# Altium schematic sheet p2_eth_rs232.SchDoc
size A1; Organization: Protel International P/L; Address1: L3, 12a Rodborough Rd; Address2: Frenchs Forest; Address3: NSW; Address4: Australia 2086
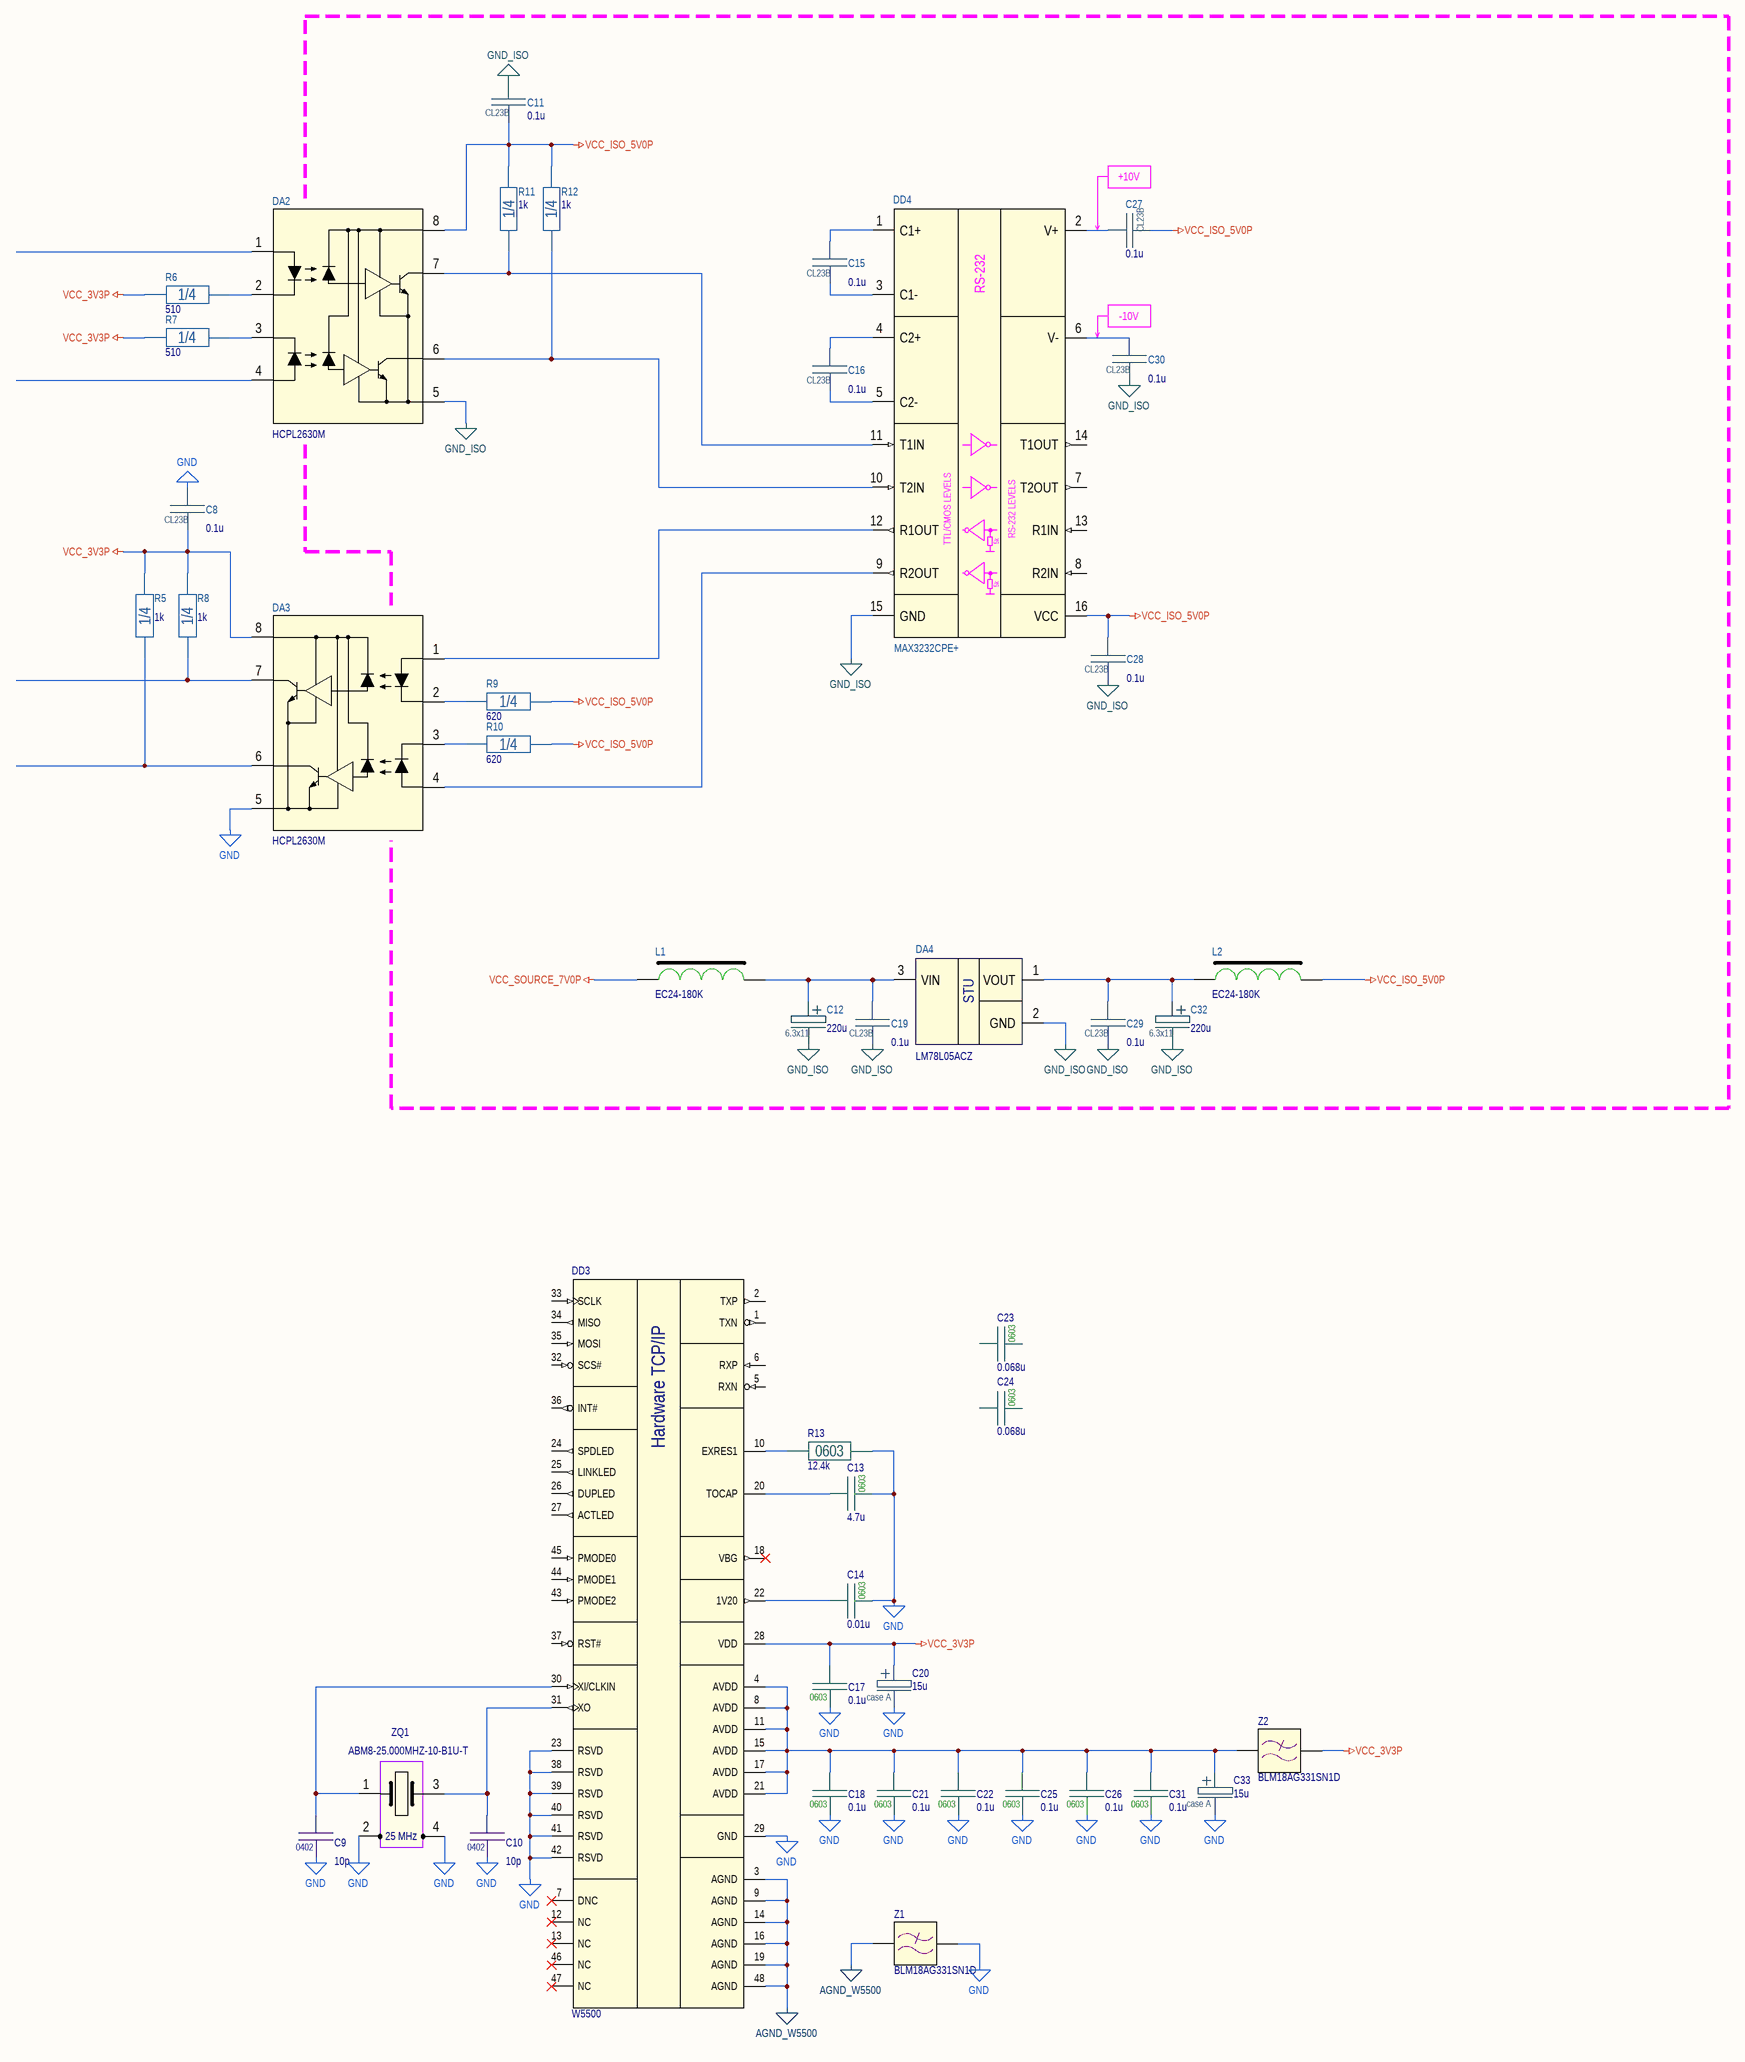
[diagram p0: p2_eth_rs232.SchDoc]

## Parts
C8  0.1u  [CL23B_7.2x2.5]
C9  10p  Package: 0402  [CAP0402]
C10  10p  Package: 0402  [CAP0402]
C11  0.1u  [CL23B_7.2x2.5]
C12  220u  Package: 6.3x11  [ECAP6.3X11X2.5_BRW]
C13  4.7u  Package: 0603  [CAP0603]
C14  0.01u  Package: 0603  [CAP0603]
C15  0.1u  [CL23B_7.2x2.5]
C16  0.1u  [CL23B_7.2x2.5]
C17  0.1u  Package: 0603  [CAP0603]
C18  0.1u  Package: 0603  [CAP0603]
C19  0.1u  [CL23B_7.2x2.5]
C20  15u  Package: case A  [CAP_CASE_A]
C21  0.1u  Package: 0603  [CAP0603]
C22  0.1u  Package: 0603  [CAP0603]
C23  0.068u  Package: 0603  [CAP0603]
C24  0.068u  Package: 0603  [CAP0603]
C25  0.1u  Package: 0603  [CAP0603]
C26  0.1u  Package: 0603  [CAP0603]
C27  0.1u  [CL23B_7.2x2.5]
C28  0.1u  [CL23B_7.2x2.5]
C29  0.1u  [CL23B_7.2x2.5]
C30  0.1u  [CL23B_7.2x2.5]
C31  0.1u  Package: 0603  [CAP0603]
C32  220u  Package: 6.3x11  [ECAP6.3X11X2.5_BRW]
C33  15u  Package: case A  [CAP_CASE_A]
DA2  HCPL2630M  [DIP-8P-M01]
DA3  HCPL2630M  [DIP-8P-M01]
DA4  LM78L05ACZ  [TO-92 (VERTICAL,LINE)]
DD3  W5500  [LQFP-48]
DD4  MAX3232CPE+  [DIP-16P-M03]
L1  EC24-180K  [EC24_GREEN]
L2  EC24-180K  [EC24_GREEN]
R5  1k  Package: 1/4  [CFR-25]
R6  510  Package: 1/4  [CFR-25]
R7  510  Package: 1/4  [CFR-25]
R8  1k  Package: 1/4  [CFR-25]
R9  620  Package: 1/4  [CFR-25]
R10  620  Package: 1/4  [CFR-25]
R11  1k  Package: 1/4  [CFR-25]
R12  1k  Package: 1/4  [CFR-25]
R13  12.4k  Package: 0603  [RES0603B]
Z1  BLM18AG331SN1D  [BLM0603P]
Z2  BLM18AG331SN1D  [BLM0603P]
ZQ1  ABM8-25.000MHZ-10-B1U-T  [SMD3225]

## Nets
AGND_W5500: DD3.3(AGND) DD3.9(AGND) DD3.14(AGND) DD3.16(AGND) DD3.19(AGND) DD3.48(AGND) Z1.2
GND: C8.1 C9.1 C10.1 C13.2 C14.2 C17.1 C18.1 C20.2 C21.1 C22.1 C25.1 C26.1 C31.1 C33.2 DA3.5(GND) DD3.23(RSVD) DD3.29(GND) DD3.38(RSVD) DD3.39(RSVD) DD3.40(RSVD) DD3.41(RSVD) DD3.42(RSVD) R13.2 Z1.1 ZQ1.2(GND) ZQ1.4(GND)
GND_ISO: C11.1 C12.2 C19.2 C28.2 C29.2 C30.2 C32.2 DA2.5(GND) DA4.2(GND) DD4.15(GND)
VCC_3V3P: C8.2 C17.2 C20.1 DA3.8(VCC) DD3.28(VDD) R5.1 R6.1 R7.1 R8.1 Z2.1
VCC_ISO_5V0P: C11.2 C27.2 C28.1 DA2.8(VCC) DD4.16(VCC) L2.2 R9.1 R10.1 R11.1 R12.1
VCC_SOURCE_7V0P: L1.1
NetC9_2: C9.2 DD3.30(XI/CLKIN) ZQ1.1(XTAL0)
NetC10_2: C10.2 DD3.31(XO) ZQ1.3(XTAL1)
NetC12_1: C12.1 C19.1 DA4.3(VIN) L1.2
NetC13_1: C13.1 DD3.20(TOCAP)
NetC14_1: C14.1 DD3.22(1V20)
NetC15_1: C15.1 DD4.1(C1+)
NetC15_2: C15.2 DD4.3(C1-)
NetC16_1: C16.1 DD4.4(C2+)
NetC16_2: C16.2 DD4.5(C2-)
NetC18_2: C18.2 C21.2 C22.2 C25.2 C26.2 C31.2 C33.1 DD3.4(AVDD) DD3.8(AVDD) DD3.11(AVDD) DD3.15(AVDD) DD3.17(AVDD) DD3.21(AVDD) Z2.2
NetC27_1: C27.1 DD4.2(V+)
NetC29_1: C29.1 C32.1 DA4.1(VOUT) L2.1
NetC30_1: C30.1 DD4.6(V-)
NetDA2_2: DA2.2(CATHODE1) R6.2
NetDA2_3: DA2.3(CATHODE2) R7.2
NetDA2_6: DA2.6(V02) DD4.10(T2IN) R12.2
NetDA2_7: DA2.7(V01) DD4.11(T1IN) R11.2
NetDA3_1: DA3.1(ANODE1) DD4.12(R1OUT)
NetDA3_2: DA3.2(CATHODE1) R9.2
NetDA3_3: DA3.3(CATHODE2) R10.2
NetDA3_4: DA3.4(ANODE2) DD4.9(R2OUT)
NetDA3_6: DA3.6(V02) R5.2
NetDA3_7: DA3.7(V01) R8.2
NetDD3_10: DD3.10(EXRES1) R13.1

Not connected (* = marked no-connect by the designer): C23 1 2; C24 1 2; DA2 1(ANODE1) 4(ANODE2); DD3 1(TXN) 2(TXP) 5(RXN) 6(RXP) 7(DNC)* 12(NC)* 13(NC)* 18(VBG)* 24(SPDLED) 25(LINKLED) 26(DUPLED) 27(ACTLED) 32(SCS#) 33(SCLK) 34(MISO) 35(MOSI) 36(INT#) 37(RST#) 43(PMODE2) 44(PMODE1) 45(PMODE0) 46(NC)* 47(NC)*; DD4 7(T2OUT) 8(R2IN) 13(R1IN) 14(T1OUT)

## Notes on the sheet
- +10V
- -10V
- Title
- Size:
- Date:
- File:
- A1
- Number:
- Time:
- Revision:
- Sheet
- of
- (in symbol ABM8-25.000MHZ-10-B1U-T) 25 MHz
- (in symbol LM78L05ACZ) STU
- (in symbol MAX3232CPE+) RS-232; TTL/CMOS LEVELS; RS-232 LEVELS; 5k
- (in symbol W5500) Hardware TCP/IP

## Library data of the parts
C8 C11 C15 C16 C19 C27-C30 = CL23B: Box-type metallized polyester film capacitor; Tolerance: ± * %; Voltage: 63V; Value: 0.1u; Dielectric: Polyester; Value on schem: 0.1u; Part Number: *; Manufacturer: *; Package: CL23B
C9 C10 = C0402: Capacitors 0402 package case; Part Number: CL05C100JB5NNNC; Manufacturer: Samsung Sdi Co.ltd(SAMSUNG); Tolerance: ± 10 %; Dielectric: NP0; Voltage: 50 V; Value: 10p; Value on schem: 10p
C12 C32 = C_ECAP: Aluminium capacitor; Part Number: EKZH160ELL221MF11D; Manufacturer: Nichicon; Tolerance: ± 20 %; Voltage: 16V; Value: 220u; Value on schem: 220u
C13 = C0603: Capacitors 0603 package case; Part Number: CL10A475MO8NNNC; Manufacturer: Samsung Sdi Co. Ltd; Tolerance: ± 10 %; Dielectric: X5R; Voltage: 16 V; Value: 4.7u; Value on schem: 4.7u
C14 = C0603: Capacitors 0603 package case; Part Number: CL10B103KB8NNNL; Manufacturer: Samsung Sdi Co. Ltd; Tolerance: ± 10 %; Dielectric: X7R; Voltage: 50 V; Value: 0.01u; Value on schem: 0.01u
C17 C18 C21 C22 C25 C26 C31 = C0603: Capacitors 0603 package case; Part Number: CL10B104KB8NNNC; Manufacturer: Samsung Sdi Co. Ltd; Tolerance: ± 10 %; Dielectric: X7R; Voltage: 50V; Value: 0.1u; Value on schem: 0.1u
C20 C33 = C_CASEA: Tantalum capacitors case A; Part Number: 293D156X96R3A2TE3; Manufacturer: Vishay Intertechnology Inc.; Tolerance: ± 10 %; Voltage: 6.3V; ESR: 2.9Ohm @ 100 kHz; Value: 15u; Value on schem: 15u; Series: 293D
C23 C24 = C0603: Capacitors 0603 package case; Part Number: CL10B683KB8NNNC; Manufacturer: Samsung Sdi Co. Ltd; Tolerance: ± 10 %; Dielectric: X7R; Voltage: 50 V; Value: 0.068u; Value on schem: 0.068u
DA2 DA3 = HCPL2630M: Dual-Channel High-Speed 10 MBit/s Logic Gate Optocouplers; Manufacturer: ON Semiconductor; Package: DIP-8; Part Number: HCPL2630M
DA4 = LM78L05ACZ: 100-mA Fixed Output Linear Regulator; Manufacturer: Texas Instruments; Part Number: LM78L05ACZ; Package: TO-92
DD3 = W5500: Hardwired TCP/IP embedded Ethernet controller; Manufacturer: WIZnet; Part Number: W5500; Package: LQFP-64
DD4 = MAX3232CPE+: 3.0V to 5.5V, Low-Power, Up to 1Mbps, True RS-232 Transceivers; Manufacturer: Maxim Integrated; Part Number: MAX3232CPE+; Package: DIP-16
L1 L2 = EC24: Axial leaded coated inductors; Manufacturer: 3L Electronic; RDC: 1 Ohm; SRF Min: 15 MHz; Q: 40; Irms  Max: 315 mA; Inductance @ 100 kHz: 18 µH; Part Number: EC24-180K; Package: EC24
R5 R8 R11 R12 = CF25: Resistor 1/4W; Part Number: MFR-25FTF52-1K; Manufacturer: Yageo; Tolerance: ± 1 %; Voltage: 250V; Temperature Coefficient: ±100 ppm/°C; Value: 1k; Value on schem: 1k
R6 R7 = CF25: Resistor 1/4W; Part Number: MFR-25FTF52-510R; Manufacturer: Yageo; Tolerance: ± 1 %; Voltage: 250V; Temperature Coefficient: ±100 ppm/°C; Value: 510; Value on schem: 510
R9 R10 = CF25: Resistor 1/4W; Part Number: MFR-25FTF52-620R; Manufacturer: Yageo; Tolerance: ± 1 %; Voltage: 250V; Temperature Coefficient: ±100 ppm/°C; Value: 620; Value on schem: 620
R13 = R0603: Resistor 0603 package case; Part Number: RC0603FR-0712K4L; Manufacturer: Yageo; Tolerance: ± 1 %; Value: 12.4k; Value on schem: 12.4k
Z1 Z2 = BLM18AG331SN1D: Power line filter, imperdance 330 Ohm (current 05A); Part Number: BLM18AG331SN1D; Package: 0603
ZQ1 = ABM8-25.000MHZ-10-B1U-T: Quartz Crystal (Frequency Stability ±10ppm); Manufacturer: Abracon LLC; Load Capacitance: 10pF; PartNumber: ABM8-25.000MHZ-10-B1U-T; Package: SMD3225; Frequency Tolerance: ±10ppm; Frequency Stability: ±10ppm